# Altium schematic sheet TopLevel.SchDoc
size A4
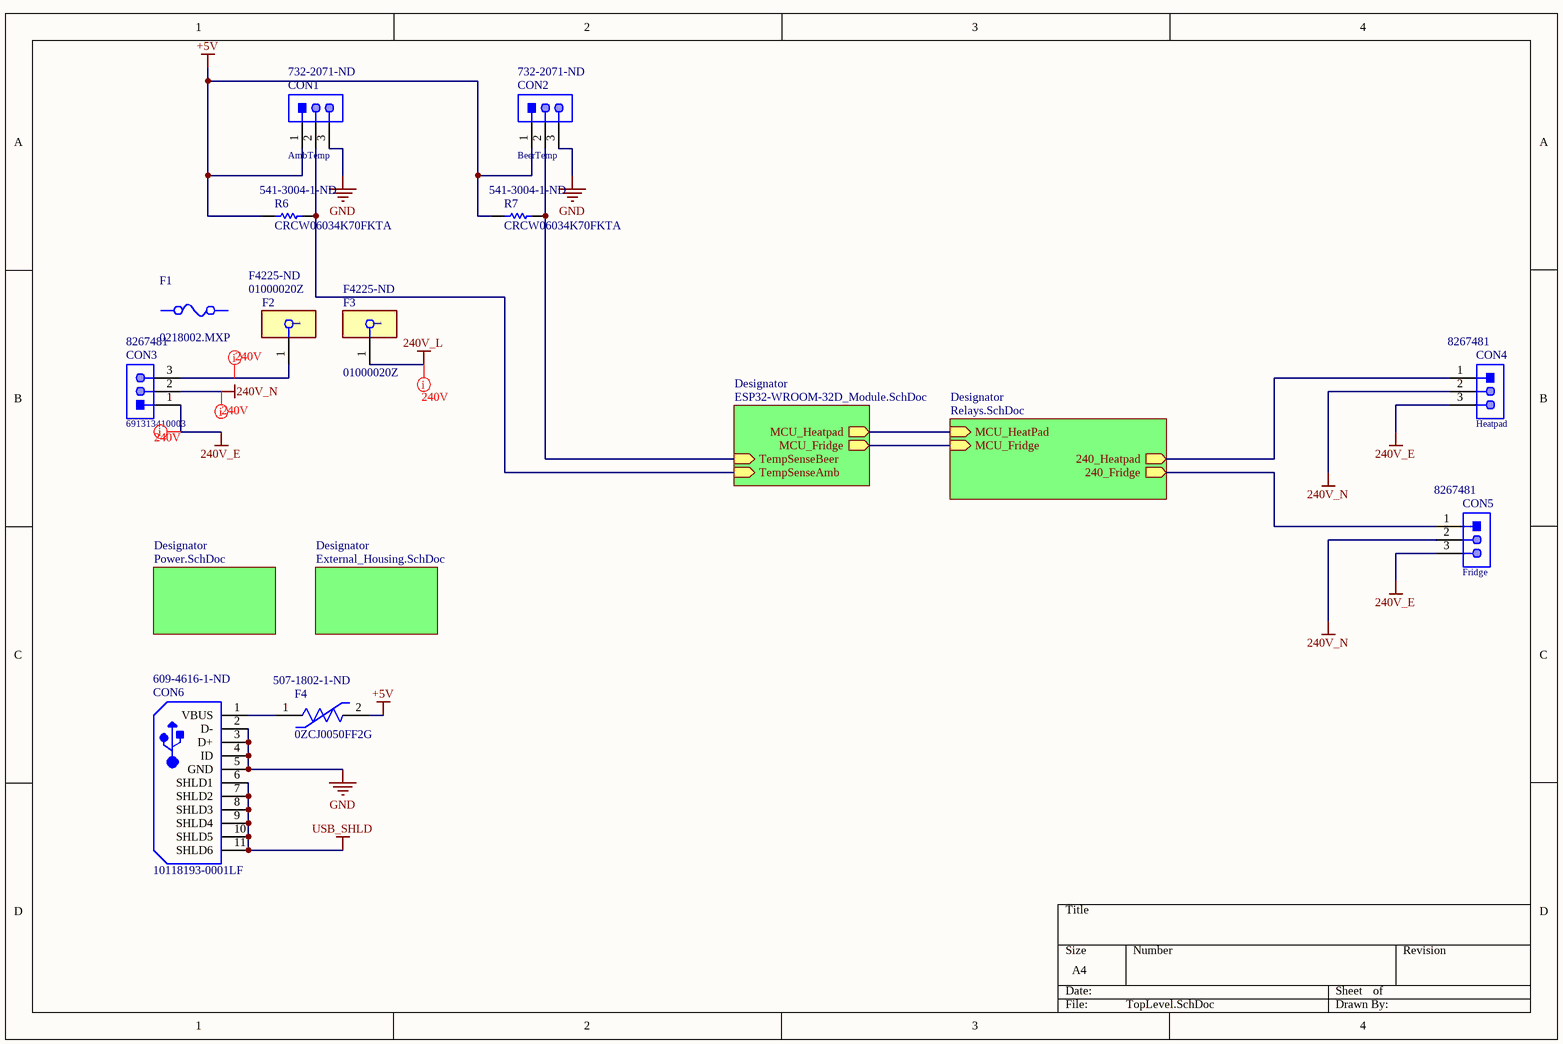
[diagram p0: TopLevel.SchDoc]

## Parts
CON1  AmbTemp  Supplier Part Number 1: 732-2071-ND  [691313510003]
CON2  BeerTemp  Supplier Part Number 1: 732-2071-ND  [691313510003]
CON3  691313410003  Supplier Part Number 1: 8267481  [691313410003]
CON4  Heatpad  Supplier Part Number 1: 8267481  [691313410003]
CON5  Fridge  Supplier Part Number 1: 8267481  [691313410003]
CON6  10118193-0001LF  Supplier Part Number 1: 609-4616-1-ND  [FCI-10118193-0001LF-5_V]
F1  0218002.MXP  [FP-0218002_MXP-MFG]
F2  01000020Z  Supplier Part Number 1: F4225-ND  [FP-0100-MFG]
F3  01000020Z  Supplier Part Number 1: F4225-ND  [FP-0100-MFG]
F4  0ZCJ0050FF2G  Supplier Part Number 1: 507-1802-1-ND  [FP-0ZCJ0050FF2G-MFG]
R6  CRCW06034K70FKTA  Supplier Part Number 1: 541-3004-1-ND  [RESC1609X50X30NL10T20]
R7  CRCW06034K70FKTA  Supplier Part Number 1: 541-3004-1-ND  [RESC1609X50X30NL10T20]

## Sub-sheets
Designator = Relays.SchDoc: MCU_HeatPad (in), MCU_Fridge (in), 240_Heatpad (out), 240_Fridge (out)
Designator = ESP32-WROOM-32D_Module.SchDoc: MCU_Fridge (out), MCU_Heatpad (out), TempSenseAmb (in), TempSenseBeer (in)
Designator = Power.SchDoc: no entries
Designator = External_Housing.SchDoc: no entries

## Nets
240V_E: CON3.1 CON4.3 CON5.3
240V_L: F3.1
240V_N: CON3.2 CON4.2 CON5.2
+5V: CON1.1 CON2.1 F4.2 R6.1 R7.1
GND: CON1.3 CON2.3 CON6.2(D-) CON6.3(D+) CON6.4(ID) CON6.5(GND)
USB_SHLD: CON6.6(SHLD1) CON6.7(SHLD2) CON6.8(SHLD3) CON6.9(SHLD4) CON6.10(SHLD5) CON6.11(SHLD6)
NetCON1_2: CON1.2 R6.2 ; sheet Designator/TempSenseAmb
NetCON2_2: CON2.2 R7.2 ; sheet Designator/TempSenseBeer
NetCON3_3: CON3.3 F2.1
NetCON4_1: CON4.1 ; sheet Designator/240_Heatpad
NetCON5_1: CON5.1 ; sheet Designator/240_Fridge
NetCON6_1: CON6.1(VBUS) F4.1
(unnamed): sheet Designator/MCU_HeatPad, sheet Designator/MCU_Heatpad
(unnamed): sheet Designator/MCU_Fridge, sheet Designator/MCU_Fridge

## Layout directives
net class 240V: 240V_E, 240V_L, 240V_N, NetCON3_3

## Library data of the parts
CON1 CON2 = CMP-1502-02193-1: Serie 313 - 5.08mm Close Horizontal PCB Header WR-TBL, 3 pin; Manufacturer: Wurth Elektronik; Pin Number: 3; Gender: Male; Number of Levels: 1; Current: 20A; Voltage: 300V; Pitch: 5.08mm; Manufacturer URL: http://www.we-online.de; Mounting Technology: THT; Publisher: WurthElektronik; Datasheet URL: http://katalog.we-online.de/em/datasheet/6913135100xx.pdf; Part Number: 691313510003; Package Reference: 691313510003; Operating Temperature: -40to105degC; Packaging: Box; Supplier 1: Digi-Key; Manufacturer Part Number: 691313510003; RoHS: Yes; Category: Terminal Blocks; Stock 1: 820; Mount: Through Hole; Contact Plating: Tin; Contact Material: Brass; Color: Green; Number of Rows: 1; Package Quantity: 450; Number of Positions Per Level: 3; Termination: Solder; Number of Contacts: 3; Length: 11.5mm; Height: 12mm; Width: 17.24mm; REACH SVHC: Unknown; ComponentLink1URL: http://www.produktinfo.conrad.com/datenblaetter/1000000-1099999/001088686-da-01-en-WR_TBL_TERMINAL_BLOCK313_691313510003.pdf?src-supplier=Conrad; ComponentLink1Description: http://www.produktinfo.conrad.com/datenblaetter/1000000-1099999/001088686-da-01-en-WR_TBL_TERMINAL_BLOCK313_691313510003.pdf?src-supplier=Conrad; ComponentLink2URL: https://www.distrelec.bizhttp://katalog.we-online.de/em/datasheet/6913135100xx.pdf?mime=application%2Fpdf&src-supplier=Distrelec; ComponentLink2Description: https://www.distrelec.bizhttp://katalog.we-online.de/em/datasheet/6913135100xx.pdf?mime=application%2Fpdf&src-supplier=Distrelec; ComponentLink3URL: http://www.farnell.com/datasheets/1442232.pdf?src-supplier=Element14; ComponentLink3Description: http://www.farnell.com/datasheets/1442232.pdf?src-supplier=Element14; ComponentLink4URL: http://katalog.we-online.de/kataloge/eican/media/pdf/6913135100xx.pdf?src-supplier=Newark; ComponentLink4Description: http://katalog.we-online.de/kataloge/eican/media/pdf/6913135100xx.pdf?src-supplier=Newark; ComponentLink5URL: https://katalog.we-online.de/em/datasheet/6913135100xx.pdf?src-supplier=Digi-Key; ComponentLink5Description: https://katalog.we-online.de/em/datasheet/6913135100xx.pdf?src-supplier=Digi-Key; ComponentLink6URL: http://katalog.we-online.de/kataloge/eican/media/pdf/6913135100xx.pdf?src-supplier=Farnell; ComponentLink6Description: http://katalog.we-online.de/kataloge/eican/media/pdf/6913135100xx.pdf?src-supplier=Farnell
CON3-CON5 = CMP-1502-02425-1: Serie 3134 - 7.62mm Close Horizontal PCB Header WR-TBL, 3 pin; Manufacturer: Wurth Elektronik; Gender: Male; Pin Number: 3; Number of Levels: 1; Current: 20A; Voltage: 300V; Operating Temperature: -40to105degC; Package Reference: 691313410003; Packaging: Box; Mounting Technology: THT; Publisher: WurthElektronik; Part Number: 691313410003; Datasheet URL: http://katalog.we-online.de/em/datasheet/6913134100xx.pdf; Pitch: 7.62mm; Manufacturer URL: http://www.we-online.de; Supplier 1: RSComponents; Manufacturer Part Number: 691313410003; RoHS: Yes; Category: Terminal Blocks; Stock 1: 119; Pricing 1: 1=1.28000 (AUD); Mount: Through Hole; Contact Material: Brass; Color: Green; Number of Rows: 1; Package Quantity: 300; Number of Positions Per Level: 3; Termination: Solder; Number of Contacts: 3; Length: 12.5mm; Height: 12mm; Width: 22.86mm; REACH SVHC: Unknown; ComponentLink1URL: https://datasheet.ciiva.com/795/6913134100xx-795899.pdf?src-supplier=Digi-Key; ComponentLink1Description: https://datasheet.ciiva.com/795/6913134100xx-795899.pdf?src-supplier=Digi-Key; ComponentLink2URL: https://datasheet.ciiva.com/8043/1442230-8043548.pdf?src-supplier=Element14; ComponentLink2Description: https://datasheet.ciiva.com/8043/1442230-8043548.pdf?src-supplier=Element14; ComponentLink3URL: https://datasheet.ciiva.com/48692/001088680-da-01-en-wr-tbl-terminal-block3134-691313410003-48692890.pdf?src-supplier=Conrad; ComponentLink3Description: https://datasheet.ciiva.com/48692/001088680-da-01-en-wr-tbl-terminal-block3134-691313410003-48692890.pdf?src-supplier=Conrad
CON6 = CMP-2000-05119-1: Micro USB B Type Receptacle, -55 to 85 degC, 5-Pin SMD, RoHS, Tape and Reel; Manufacturer: FCI; Insulation Resistance: 1000MOhms; Gender: Female; Current Rating: 1.8A; Number of Contacts: 5Contact; Connector Type: MicroUSBTypeBreceptacle; Mounting Angle: Right; Number of Ports: 1; Max Voltage Rating (AC): 100V; Pitch: 0.65mm; Datasheet Version: Rev. C, 05/2015; Packaging: Reel; Product Category: USBConnectors; Standard: USB2.0; Factory Pack Quantity: 1200; Operating Temperature Range: -55Cto+85C; Termination Style: SMD/SMT; Datasheet URL: http://datasheet.octopart.com/10118193-0001LF-FCI-datasheet-55953155.pdf; Contact Material: CopperAlloy; RoHS: Details; Contact Plating: Gold; Flammability Rating: UL94V-0; Manufacturer URL: http://www.fci.com/; Brand: FCI; Product: MicroUSBTypeBConnectors; Color: Black; Supplier 1: Digi-Key; Manufacturer Part Number: 10118193-0001LF; Category: USB Connectors; Stock 1: 49167; Mount: Surface Mount,Horizontal; Number of Terminals: 5; Housing Material: Polymer; Min Operating Temperature: -55°C; Max Operating Temperature: 85°C; Termination: Solder; Orientation: Right Angle; Package Quantity: 1200; Voltage Rating: 100V; Features: Shielded; Length: 7.86mm; Depth: 5.67mm; Radiation Hardening: No; ComponentLink1URL: https://datasheet.ciiva.com/851/10118193-851106.pdf?src-supplier=Digi-Key; ComponentLink1Description: https://datasheet.ciiva.com/851/10118193-851106.pdf?src-supplier=Digi-Key; ComponentLink2URL: https://datasheet.ciiva.com/4598/10118193ac-197151-4598799.pdf?src-supplier=Mouser; ComponentLink2Description: https://datasheet.ciiva.com/4598/10118193ac-197151-4598799.pdf?src-supplier=Mouser; ComponentLink3URL: https://datasheet.ciiva.com/26853/getdatasheetpartid-418618-26853893.pdf?src-supplier=Verical; ComponentLink3Description: https://datasheet.ciiva.com/26853/getdatasheetpartid-418618-26853893.pdf?src-supplier=Verical; ComponentLink4URL: https://datasheet.ciiva.com/14802/10118193-0001lf-webpage-14802386.pdf?src-supplier=Arrow+Electronics; ComponentLink4Description: https://datasheet.ciiva.com/14802/10118193-0001lf-webpage-14802386.pdf?src-supplier=Arrow+Electronics; ComponentLink5URL: https://datasheet.ciiva.com/851/10118193-851108.pdf?src-supplier=Digi-Key; ComponentLink5Description: https://datasheet.ciiva.com/851/10118193-851108.pdf?src-supplier=Digi-Key; ComponentLink6URL: https://datasheet.ciiva.com/851/10118193-851107.pdf?src-supplier=Digi-Key; ComponentLink6Description: https://datasheet.ciiva.com/851/10118193-851107.pdf?src-supplier=Digi-Key; ComponentLink7URL: https://datasheet.ciiva.com/14618/70236827-14618887.pdf?src-supplier=Allied+Electronics; ComponentLink7Description: https://datasheet.ciiva.com/14618/70236827-14618887.pdf?src-supplier=Allied+Electronics
F1 = CMP-08605-000057-1: FUSE GLASS 2A 250VAC 5X20MM; Manufacturer: Littelfuse Inc; Value: 0.0293Ω; Fuse I2T: 14.45A2Sec; Fuse Interrupt Ac Current: 35A; Max Fuse Ac Voltage: 250V; Fuse Voltage Drop: 150mV; Fuse Blow Speed: Slow; Fuse Current: 2A; Device Class L1: Circuit Protection; Device Class L2: Fuses; ComponentLink2URL: https://www.littelfuse.com/~/media/electronics/datasheets/fuses/littelfuse_fuse_218_datasheet.pdf.pdf; Lead Free: Yes; Category: Fuse; Automotive: No; Resistance: 0.0293Ω; Height: 5.3mm; RoHS: TRUE; Octopart: https://octopart.com/0218002.mxp-littelfuse-558306; Temperature Range Low: -55°C; ComponentLink2Description: Datasheet; Package: 0; Voltage Rating: 250V; Mouser Description: Cartridge Fuses 250V 2A Time Lag (Slo-Blo); Digikey Description: FUSE GLASS 2A 250VAC 5X20MM; Manufacturer Part Number: 0218002.MXP; Temperature: -55°C to +125°C; Device Class L3: unset; Temperature Range High: +125°C
F2 F3 = CMP-08604-000025-1: FUSE CLIP CARTRIDGE 600V 20A PCB; Manufacturer: Littelfuse; Number of Circuits: 1; Voltage Rating: 250V; Body Material: Bronze; Contact Material: Bronze; Contact Plating: Tin; Depth: 5.9mm; Length: 4.1mm; Mount: PCB; Package Quantity: 1000; Packaging: Bulk; Current Rating: 20A; Voltage: 600V; Termination: PC Pin; Orientation: Horizontal; Supplier 1: Digi-Key; Manufacturer Part Number: 01000020Z; RoHS: Yes; Category: Fuse Holders; Stock 1: 20344; ComponentLink1URL: https://datasheet.ciiva.com/4479/littelfuse-100-445-030-520-fuseclip-195180-4479865.pdf?src-supplier=Mouser; ComponentLink1Description: https://datasheet.ciiva.com/4479/littelfuse-100-445-030-520-fuseclip-195180-4479865.pdf?src-supplier=Mouser
F4 = CMP-16043-000004-1: PTC RESET FUSE 8V 500MA 1206; Manufacturer: Bel; Time to Trip: 0.1s; Max Current Rating: 100A; Trip Current: 1A; Hold Current: 500mA; Packaging: Tape and Reel; Package Quantity: 1; Max Operating Temperature: 85°C; Min Operating Temperature: -40°C; Lead Free: Lead Free; Case/Package: 1206; Case Code (Metric): 3216; Mount: Surface Mount; Case Code (Imperial): 1206; Contact Plating: Tin; Supplier 1: Digi-Key; Manufacturer Part Number: 0ZCJ0050FF2G; RoHS: Yes; Category: PTC Resettable Fuses; Stock 1: 196684; ComponentLink1URL: http://www.farnell.com/datasheets/2571638.pdf?src-supplier=Farnell; ComponentLink1Description: http://www.farnell.com/datasheets/2571638.pdf?src-supplier=Farnell; ComponentLink2URL: https://www.belfuse.com/resources/CircuitProtection/datasheets/0ZCJ%20Nov2016.pdf?src-supplier=Digi-Key; ComponentLink2Description: https://www.belfuse.com/resources/CircuitProtection/datasheets/0ZCJ%20Nov2016.pdf?src-supplier=Digi-Key; ComponentLink3URL: http://belfuse.com/pdfs/0ZCJ.pdf?src-supplier=Avnet; ComponentLink3Description: http://belfuse.com/pdfs/0ZCJ.pdf?src-supplier=Avnet; ComponentLink4URL: http://belfuse.com/pdfs/0ZCJ.pdf?src-supplier=Avnet+Asia; ComponentLink4Description: http://belfuse.com/pdfs/0ZCJ.pdf?src-supplier=Avnet+Asia; ComponentLink5URL: http://www.farnell.com/datasheets/2571638.pdf?src-supplier=Newark; ComponentLink5Description: http://www.farnell.com/datasheets/2571638.pdf?src-supplier=Newark
R6 R7 = CMP-2000-03412-1: 0603 4K7; Manufacturer: Vishay Dale; Resistance: 4.7kR; Power Rating: 100mW; Tolerance: 1%; Voltage Rating: 75V; Temperature Coefficient: 100ppm/°C; Part Number: CRCW06034K70FKTA; Supplier 1: Digi-Key; Manufacturer Part Number: CRCW06034K70FKTA; RoHS: Yes; Category: Chip SMD Resistors; Stock 1: 384; Case/Package: 0603; Weight: 7.1E-05oz; Case Code (Metric): 1608; Case Code (Imperial): 0603; Contact Plating: Tin,Lead; Min Operating Temperature: -55°C; Max Operating Temperature: 155°C; Resistor Type: Thick Film; Package Quantity: 5000; Packaging: Tape and Reel; Number of Terminations: 2; Max Power Dissipation: 100mW; Voltage Rating (DC): 75V; Power Dissipation: 100mW; Features: Automotive AEC-Q200; Length: 1.55mm; Height: 0.02inch; Width: 0.033inch; Depth: 0.85mm; Radiation Hardening: No; Lead Free: Contains Lead; Military Standard: Not; ComponentLink1URL: https://datasheet.ciiva.com/2565/dcrcw-2565426.pdf?src-supplier=Digi-Key; ComponentLink1Description: https://datasheet.ciiva.com/2565/dcrcw-2565426.pdf?src-supplier=Digi-Key; ComponentLink2URL: https://datasheet.ciiva.com/9071/dcrcw-9071351.pdf?src-supplier=Avnet; ComponentLink2Description: https://datasheet.ciiva.com/9071/dcrcw-9071351.pdf?src-supplier=Avnet